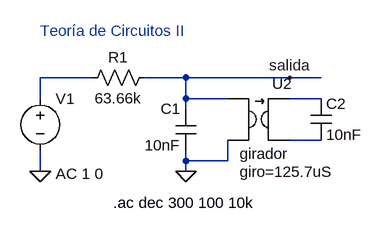
[diagram p0: schematic Filtro pasabanda con girador.asc]
Filtro pasabanda con girador.asc, the LTspice schematic file:
Version 4
SHEET 1 880 680
WIRE -1136 160 -1216 160
WIRE -992 160 -1056 160
WIRE -832 160 -992 160
WIRE -784 160 -832 160
WIRE -1216 192 -1216 160
WIRE -992 192 -992 160
WIRE -928 192 -992 192
WIRE -784 192 -832 192
WIRE -992 208 -992 192
WIRE -784 256 -832 256
WIRE -992 288 -992 272
WIRE -928 288 -928 256
WIRE -928 288 -992 288
WIRE -1216 304 -1216 272
WIRE -992 304 -992 288
FLAG -1216 304 0
FLAG -832 160 salida
FLAG -992 304 0
SYMBOL res -1040 144 R90
WINDOW 0 0 56 VBottom 0
WINDOW 3 32 56 VTop 0
SYMATTR InstName R1
SYMATTR Value 63.66k
SYMBOL cap -976 272 R180
WINDOW 0 24 64 Left 0
WINDOW 3 24 8 Left 0
SYMATTR InstName C1
SYMATTR Value 10nF
SYMBOL voltage -1216 176 R0
WINDOW 123 24 132 Left 0
WINDOW 39 0 0 Left 0
SYMATTR Value2 AC 1 0
SYMATTR InstName V1
SYMATTR Value ""
SYMBOL girador -880 160 R0
WINDOW 3 -29 145 Left 0
SYMATTR Value giro=125.7uS
SYMATTR InstName U2
SYMBOL cap -800 192 R0
SYMATTR InstName C2
SYMATTR Value 10nF
TEXT -1104 352 Left 0 !.ac dec 300 100 10k
TEXT -1216 88 Left 0 ;Teoría de Circuitos II

The netlist it stands for:
* Filtro pasabanda con girador.asc
R1 salida N001 63.66k
C1 0 salida 10nF
V1 N001 0 AC 1 0
XU2 salida 0 N002 N003 girador giro=125.7uS  ; pins 1 2 3 4
C2 N002 N003 10nF
.ac dec 300 100 10k
* Teoría de Circuitos II
.lib ..\sym\Circuitos2\ComponentesIdeales\compoideales.lib
.backanno
.end